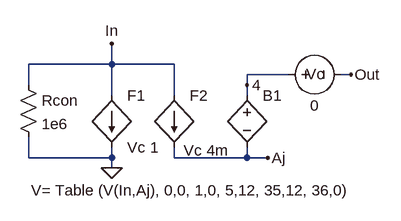
[diagram p0: schematic 7805Jerarq.asc]
7805Jerarq.asc, the LTspice schematic file:
Version 4
SHEET 1 880 680
WIRE -16 208 -16 176
WIRE -16 208 -144 208
WIRE 80 208 -16 208
WIRE 256 224 192 224
WIRE 352 224 336 224
WIRE -144 240 -144 208
WIRE 192 240 192 224
WIRE -16 256 -16 208
WIRE 80 256 80 208
WIRE 192 256 192 240
WIRE -144 352 -144 320
WIRE -16 352 -16 336
WIRE -16 352 -144 352
WIRE 80 352 80 336
WIRE 192 352 192 336
WIRE 192 352 80 352
WIRE 224 352 192 352
WIRE -16 368 -16 352
FLAG -16 368 0
FLAG -16 176 In
FLAG 192 240 4
FLAG 224 352 Aj
FLAG 352 224 Out
SYMBOL f -16 256 R0
SYMATTR InstName F1
SYMATTR Value Vc 1
SYMBOL res -160 224 R0
SYMATTR InstName Rcon
SYMATTR Value 1e6
SYMBOL bv 192 240 R0
WINDOW 3 -332 162 Left 0
SYMATTR Value V= Table (V(In,Aj), 0,0, 1,0, 5,12, 35,12, 36,0)
SYMATTR InstName B1
SYMBOL voltage 240 224 R270
WINDOW 0 -15 57 VTop 0
WINDOW 3 -32 56 VBottom 0
SYMATTR InstName Vc
SYMATTR Value 0
SYMBOL f 80 256 R0
WINDOW 3 15 85 Left 0
SYMATTR Value Vc 4m
SYMATTR InstName F2

The netlist it stands for:
* 7805Jerarq.asc
F1 In 0 Vc 1
Rcon In 0 1e6
B1 4 Aj V= Table (V(In,Aj), 0,0, 1,0, 5,12, 35,12, 36,0)
Vc 4 Out 0
F2 In Aj Vc 4m
.backanno
.end